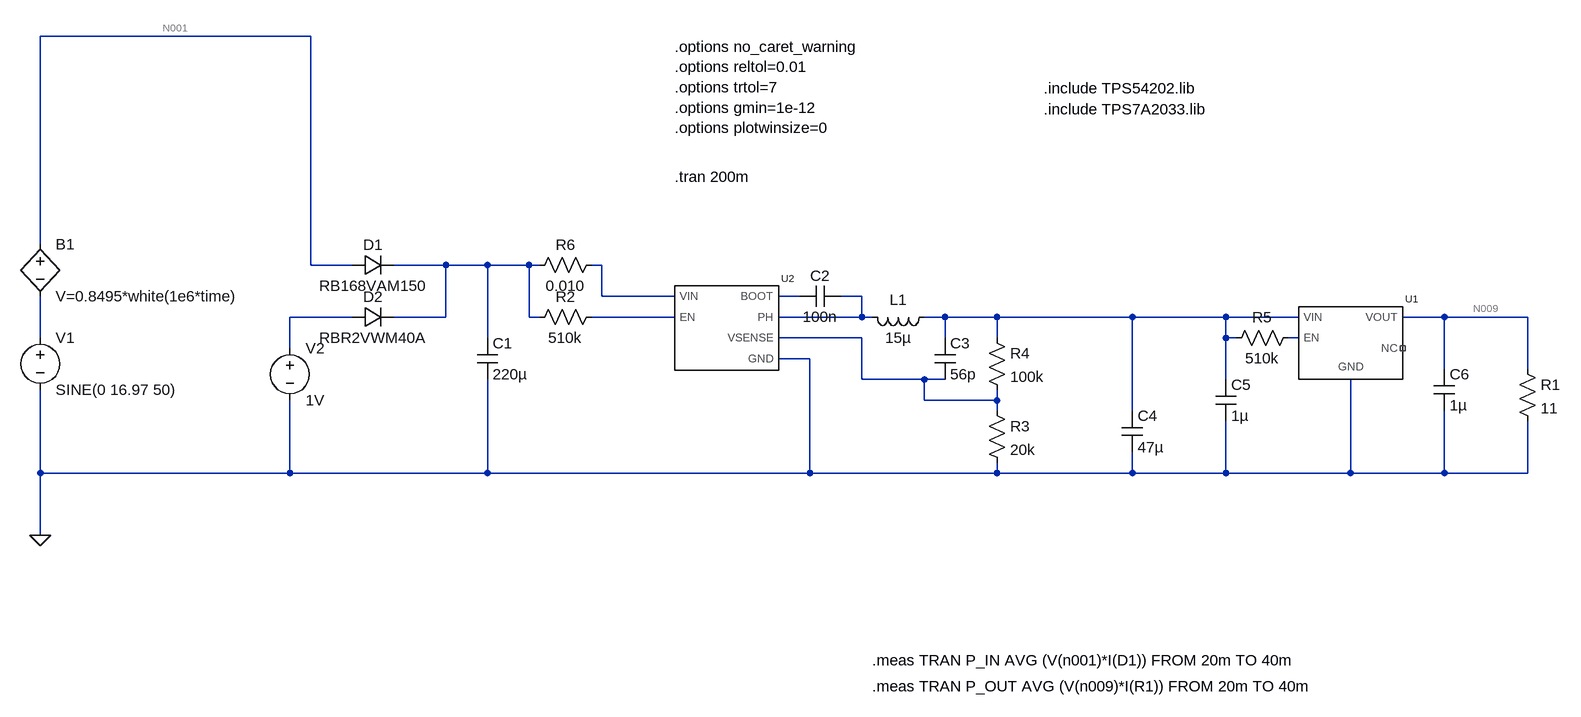
[diagram p0: schematic ALIM.asc]
ALIM.asc, the LTspice schematic file:
Version 4.1
SHEET 1 3080 904
WIRE 1152 -112 736 -112
WIRE 736 208 736 -112
WIRE 1152 240 1152 -112
WIRE 1216 240 1152 240
WIRE 1360 240 1280 240
WIRE 1424 240 1360 240
WIRE 1488 240 1424 240
WIRE 1504 240 1488 240
WIRE 1600 240 1584 240
WIRE 1600 288 1600 240
WIRE 1712 288 1600 288
WIRE 1904 288 1872 288
WIRE 2000 288 1968 288
WIRE 1216 320 1120 320
WIRE 1360 320 1360 240
WIRE 1360 320 1280 320
WIRE 1488 320 1488 240
WIRE 1504 320 1488 320
WIRE 1712 320 1584 320
WIRE 2000 320 2000 288
WIRE 2000 320 1872 320
WIRE 2016 320 2000 320
WIRE 2128 320 2096 320
WIRE 2208 320 2128 320
WIRE 2416 320 2208 320
WIRE 2560 320 2416 320
WIRE 2672 320 2560 320
WIRE 2896 320 2832 320
WIRE 3024 320 2896 320
WIRE 736 352 736 288
WIRE 1424 352 1424 240
WIRE 2000 352 1872 352
WIRE 2128 352 2128 320
WIRE 2208 352 2208 320
WIRE 2560 352 2560 320
WIRE 2576 352 2560 352
WIRE 2672 352 2656 352
WIRE 1120 368 1120 320
WIRE 1920 384 1872 384
WIRE 2896 400 2896 320
WIRE 3024 400 3024 320
WIRE 2000 416 2000 352
WIRE 2096 416 2000 416
WIRE 2128 416 2096 416
WIRE 2560 416 2560 352
WIRE 2096 448 2096 416
WIRE 2208 448 2208 432
WIRE 2208 448 2096 448
WIRE 2208 464 2208 448
WIRE 2416 464 2416 320
WIRE 736 560 736 432
WIRE 1120 560 1120 448
WIRE 1120 560 736 560
WIRE 1424 560 1424 416
WIRE 1424 560 1120 560
WIRE 1920 560 1920 384
WIRE 1920 560 1424 560
WIRE 2208 560 2208 544
WIRE 2208 560 1920 560
WIRE 2416 560 2416 528
WIRE 2416 560 2208 560
WIRE 2560 560 2560 480
WIRE 2560 560 2416 560
WIRE 2752 560 2752 416
WIRE 2752 560 2560 560
WIRE 2896 560 2896 464
WIRE 2896 560 2752 560
WIRE 3024 560 3024 480
WIRE 3024 560 2896 560
WIRE 736 656 736 560
FLAG 736 656 0
SYMBOL voltage 736 336 R0
SYMATTR InstName V1
SYMATTR Value SINE(0 16.97 50)
SYMBOL bv 736 192 R0
SYMATTR InstName B1
SYMATTR Value V=0.8495*white(1e6*time)
SYMBOL cap 1408 352 R0
SYMATTR InstName C1
SYMATTR Value 220µ
SYMATTR SpiceLine Rser=200m
SYMBOL diode 1216 256 R270
WINDOW 0 32 32 VTop 2
WINDOW 3 0 32 VBottom 2
SYMATTR InstName D1
SYMATTR Value RB168VAM150
SYMBOL res 3008 384 R0
SYMATTR InstName R1
SYMATTR Value 11
SYMBOL TPS54202 1776 320 R0
SYMATTR SpiceModel TPS54202H
SYMATTR InstName U2
SYMBOL cap 1968 272 R90
WINDOW 0 0 32 VBottom 2
WINDOW 3 32 32 VTop 2
SYMATTR InstName C2
SYMATTR Value 100n
SYMATTR SpiceLine Rser=0.03547
SYMBOL ind 2112 304 R90
WINDOW 0 5 56 VBottom 2
WINDOW 3 32 56 VTop 2
SYMATTR InstName L1
SYMATTR Value 15µ
SYMATTR SpiceLine Rser=77m
SYMBOL cap 2112 352 R0
SYMATTR InstName C3
SYMATTR Value 56p
SYMBOL res 1600 304 R90
WINDOW 0 0 56 VBottom 2
WINDOW 3 32 56 VTop 2
SYMATTR InstName R2
SYMATTR Value 510k
SYMBOL res 2192 448 R0
SYMATTR InstName R3
SYMATTR Value 20k
SYMBOL cap 2400 464 R0
SYMATTR InstName C4
SYMATTR Value 47µ
SYMATTR SpiceLine Rser=3m
SYMBOL res 2192 336 R0
SYMATTR InstName R4
SYMATTR Value 100k
SYMBOL TPS7A2033 2720 352 R0
SYMATTR InstName U1
SYMBOL cap 2544 416 R0
SYMATTR InstName C5
SYMATTR Value 1µ
SYMBOL cap 2880 400 R0
SYMATTR InstName C6
SYMATTR Value 1µ
SYMBOL res 2672 336 R90
WINDOW 0 0 56 VBottom 2
WINDOW 3 32 56 VTop 2
SYMATTR InstName R5
SYMATTR Value 510k
SYMBOL res 1600 224 R90
WINDOW 0 0 56 VBottom 2
WINDOW 3 32 56 VTop 2
SYMATTR InstName R6
SYMATTR Value 0.010
SYMBOL diode 1216 336 R270
WINDOW 0 32 32 VTop 2
WINDOW 3 0 32 VBottom 2
SYMATTR InstName D2
SYMATTR Value RBR2VWM40A
SYMBOL voltage 1120 352 R0
SYMATTR InstName V2
SYMATTR Value 1V
TEXT 1712 104 Left 2 !.tran 200m
TEXT 2280 -32 Left 2 !.include TPS54202.lib
TEXT 2280 0 Left 2 !.include TPS7A2033.lib
TEXT 1712 -96 Left 2 !.options no_caret_warning\n.options reltol=0.01\n.options trtol=7\n.options gmin=1e-12\n.options plotwinsize=0
TEXT 2016 848 Left 2 !.meas TRAN P_IN AVG (V(n001)*I(D1)) FROM 20m TO 40m
TEXT 2016 888 Left 2 !.meas TRAN P_OUT AVG (V(n009)*I(R1)) FROM 20m TO 40m

The netlist it stands for:
* ALIM.asc
V1 N010 0 SINE(0 16.97 50)
B1 N001 N010 V=0.8495*white(1e6*time)
C1 N002 0 220µ Rser=200m
D1 N001 N002 RB168VAM150
R1 N009 0 11
X§U2 N004 N007 0 N005 N003 N011 TPS54202H  ; pins BOOT EN GND PH VIN VSENSE
C2 N005 N004 100n Rser=0.03547
L1 N008 N005 15µ Rser=77m
C3 N008 N011 56p
R2 N007 N002 510k
R3 N011 0 20k
C4 N008 0 47µ Rser=3m
R4 N008 N011 100k
X§U1 N008 0 N012 NC_01 N009 TPS7A2033  ; pins VIN GND EN NC VOUT
C5 N008 0 1µ
C6 N009 0 1µ
R5 N012 N008 510k
R6 N003 N002 0.010
D2 N006 N002 RBR2VWM40A
V2 N006 0 1V
.model D D
.lib standard.dio
.tran 200m
.include TPS54202.lib
.include TPS7A2033.lib
.options no_caret_warning
.options reltol=0.01
.options trtol=7
.options gmin=1e-12
.options plotwinsize=0
.meas TRAN P_IN AVG (V(n001)*I(D1)) FROM 20m TO 40m
.meas TRAN P_OUT AVG (V(n009)*I(R1)) FROM 20m TO 40m
.backanno
.end